# EasyEDA Pro project ProPrj_SlimeVR_BMI270_2024-07-19.epro, board PCB1_1
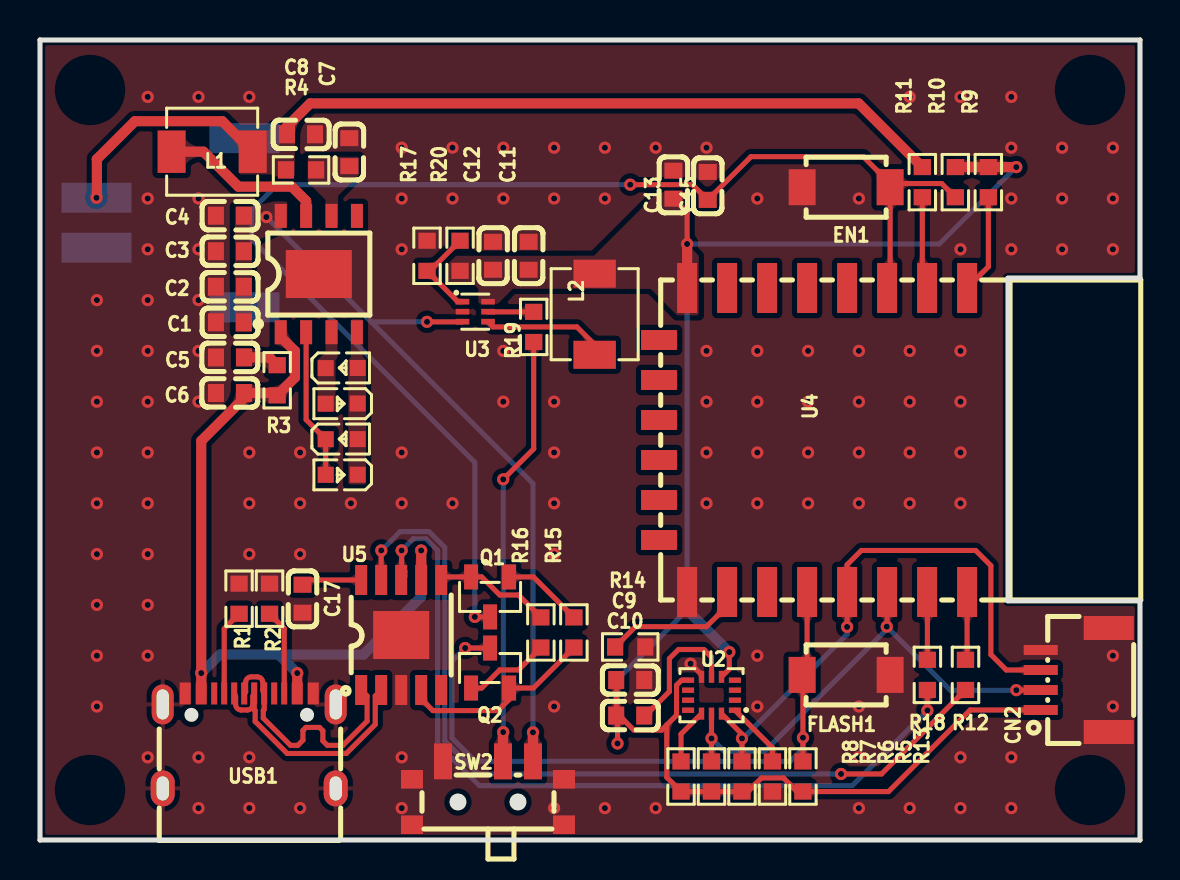
[diagram p2: board, top side]
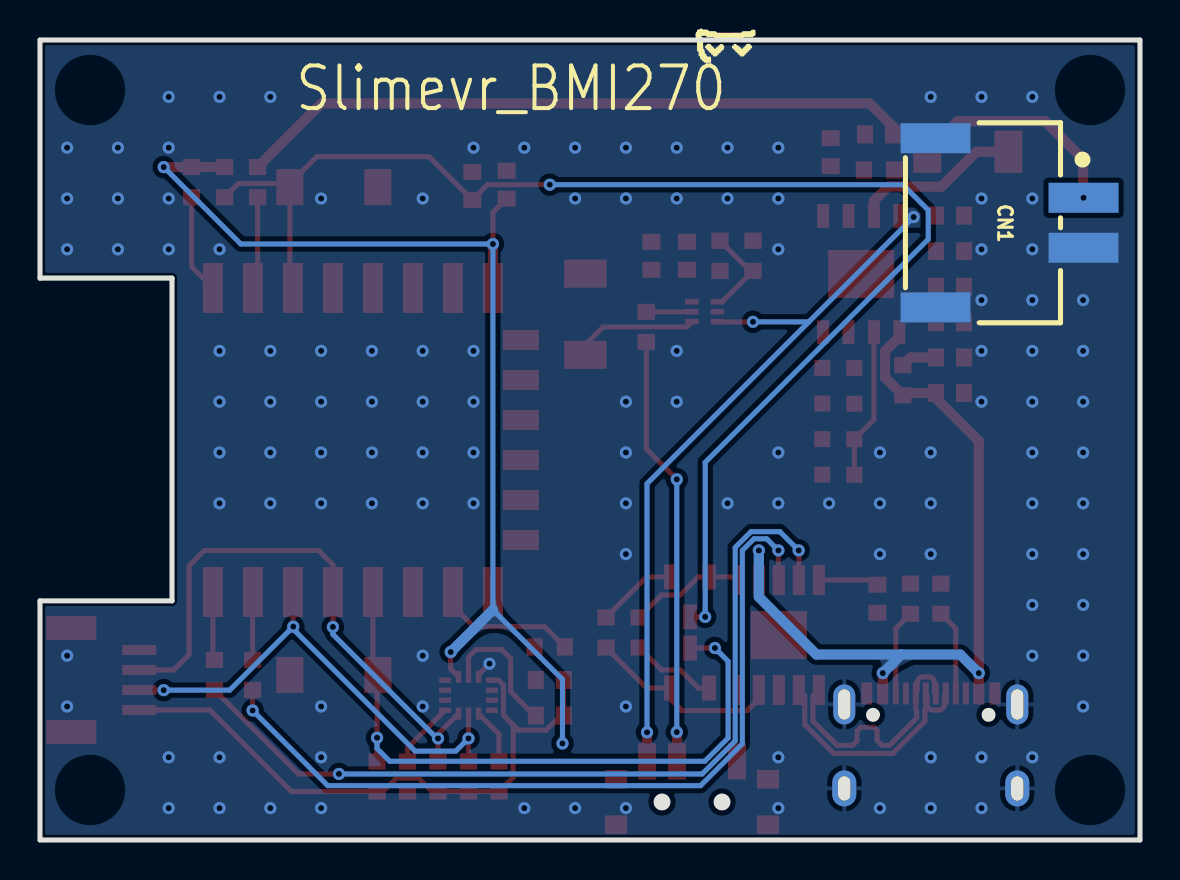
[diagram p3: board, bottom side, seen from below]

Outline 55 x 40 mm; copper layers: Top Layer, Bottom Layer. Coordinates in mm from the lower left corner of the outline.
Outline path: 0,40 0,0 55,0 55,11.96 48.4,11.96 48.4,28.09 55,28.09 55,40 0,40
Stack: Top Layer 0.035mm / Dielectric1 1.51mm FR4 er 4.5 / Bottom Layer 0.035mm

## Design rules (mm)
net D-: DP1
net D+: DP1
template: 自定义配置
spacing copperThickness1oz (default): track to track 0.102, other pairs 0.152 to 0.3
spacing copperThickness2oz: track to track 0.203, other pairs 0.152 to 0.3
track width copperThickness1oz (default): min 0.127, default 0.254, max 2.54
track width copperThickness2oz: min 0.203, default 0.254, max 2.54
differential pair differentialPair (default): width min 0.127, default 0.254, max 2.54; gap min 0.152, default 0.152
via viaSize (default): diameter min 0.5, default 0.61, max 10; hole min 0.3, default 0.305, max 6.3

## Placement (name value [footprint] x y rotation side)
C1  22uF  [C0603]  9.5 25.88 180 top
C2  22uF  [C0603]  9.5 27.66 180 top
C3  22uF  [C0603]  9.5 29.44 180 top
C4  22uF  [C0603]  9.5 31.22 180 top
C5  10uF  [C0603]  9.5 24.13 0 top
C6  10uF  [C0603]  9.5 22.35 0 top
C7  22uF  [C0603]  15.47 34.39 270 top
C8  22uF  [C0603]  13.05 35.28 180 top
C9  100nF  [C0603]  29.51 8 180 top
C10  100nF  [C0603]  29.51 6.22 180 top
C11  10uF  [C0603]  24.43 29.21 270 top
C12  10uF  [C0603]  22.65 29.21 270 top
C13  100nF  [C0603]  31.67 32.77 90 top
C15  1uF  [C0603]  33.39 32.7 270 top
C17  100nF  [C0603]  13.13 12.06 90 top
CN1  ZX-XH2.54-2PWT  [CONN-SMD_2P-P2.54_MEGASTAR_ZX-XH2.54-2PWT]  6.52 30.86 270 bottom
CN2  WAFER-SH1.0-4PWB  [CONN-SMD_4P-P1.00_WAFER-SH1.0-4PWB]  51.74 8 90 top
EN1  TS-1185-C-A-A-A  [SW-SMD_L4.0-W3.0-LS5.0-EH]  40.31 32.64 0 top
FLASH1  TS-1185-C-A-A-A  [SW-SMD_L4.0-W3.0-LS5.0-EH]  40.31 8.25 0 top
L1  1uH  [IND-SMD_L4.4-W4.2]  8.61 34.42 180 top
L2  1uH  [IND-SMD_L4.4-W4.2]  27.73 26.29 270 top
LED1  19-217/GHC-YR1S2/3T  [LED0603-RD]  15.08 18.26 180 top
LED2  NCD0603R1  [LED0603-RD_RED]  15.08 20.04 0 top
LED3  19-217/GHC-YR1S2/3T  [LED0603-RD]  15.08 21.82 180 top
LED4  NCD0603R1  [LED0603-RD_RED]  15.08 23.6 0 top
Q1  S8050  [SOT-23-3_L2.9-W1.3-P1.90-LS2.4-BR]  22.5 12.15 90 top
Q2  S8050  [SOT-23-3_L2.9-W1.3-P1.90-LS2.4-BR]  22.5 8.6 270 top
R1  5.1kΩ  [R0603]  9.95 12.06 90 top
R2  5.1kΩ  [R0603]  11.48 12.06 90 top
R3  2Ω  [R0603]  11.86 22.99 90 top
R4  500mΩ  [R0603]  13.05 33.5 180 top
R5  10K  [R0603]  36.62 3.17 90 top
R6  10K  [R0603]  35.1 3.17 270 top
R7  10K  [R0603]  33.57 3.17 270 top
R8  10K  [R0603]  32.05 3.17 270 top
R9  10kΩ  [R0603]  47.42 32.89 90 top
R10  10kΩ  [R0603]  45.77 32.89 90 top
R11  180kΩ  [R0603]  44.12 32.89 270 top
R12  0Ω  [R0603]  46.28 8.25 270 top
R13  10kΩ  [R0603]  38.15 3.17 270 top
R14  10kΩ  [R0603]  29.51 9.65 180 top
R15  10kΩ  [R0603]  26.69 10.38 90 top
R16  10kΩ  [R0603]  25.04 10.38 270 top
R17  44.2kΩ  [R0603]  19.35 29.21 270 top
R18  0Ω  [R0603]  44.37 8.25 270 top
R19  10kΩ  [R0603]  24.69 25.65 90 top
R20  200kΩ  [R0603]  21 29.21 270 top
SW2  MK-12C02-G025  [SW-SMD_MK-12C02-G025]  22.4 2.35 0 top
U1  IP5306  [ESOP-8_L4.9-W3.9-P1.27-LS6.0-BL-EP]  13.94 28.3 0 top
U2  BMI270  [LGA-14_L3.0-W2.5-P0.50-BR]  33.57 7.24 0 top
U3  MP1601GTF  [SOT-563-6_L1.6-W1.2-P0.5-LS1.6-BL]  21.76 26.42 270 top
U4  WT8266-S5 ESP-12F  [WIRELM-SMD_WT8266-S5-ESP-12F]  38.66 20 270 top
U5  CH340K  [ESOP-10_L4.9-W3.9-P1.00-LS6.2-BL-EP]  18.06 10.25 0 top
USB1  TYPE-C 16PIN 2MD(073)  [USB-C-SMD_TYPE-C-6PIN-2MD-073]  10.46 4.95 0 top

## Footprints (pads in the part's own frame, mm; a bottom-side part is the same pattern mirrored in y, then rotated)
C0603
  rect 0.8x0.9 smd: 1(-0.7,0) 2(0.7,0)
CONN-SMD_2P-P2.54_MEGASTAR_ZX-XH2.54-2PWT
  rect 1.5x3.5 smd: 1(-1.25,3.7) 2(1.25,3.7) 3(-4.23,-3.7) 4(4.23,-3.7)
CONN-SMD_4P-P1.00_WAFER-SH1.0-4PWB
  rect 0.5x1.7 smd: 1(-1.5,1.7) 2(-0.5,1.7) 3(0.5,1.7) 4(1.5,1.7)
  rect 1.2x2.5 smd: 5(-2.6,-1.7) 6(2.6,-1.7)
ESOP-8_L4.9-W3.9-P1.27-LS6.0-BL-EP
  rect 0.6x1.2 smd: 1(-1.905,-2.909) 2(-0.635,-2.909) 3(0.635,-2.909) 4(1.905,-2.909) 5(1.905,2.909) 6(0.635,2.909) 7(-0.635,2.909) 8(-1.905,2.909)
  rect 3.3x2.4 smd: 9(0,0)
ESOP-10_L4.9-W3.9-P1.00-LS6.2-BL-EP
  rect 0.6x1.5 smd: 1(-2,-2.75) 2(-1,-2.75) 3(0,-2.75) 4(1,-2.75) 5(2,-2.75) 6(2,2.75) 7(1,2.75) 8(0,2.75) 9(-1,2.75) 10(-2,2.75)
  rect 2.8x2.4 smd: 11(0,0)
IND-SMD_L4.4-W4.2
  rect 1.4x2.12 smd: 1(2.028,0) 2(-2.028,0)
LED0603-RD
  rect 0.8x0.8 smd: 1(-0.799,-0.004) 2(0.799,0.004)
LED0603-RD_RED
  rect 0.8x0.8 smd: 1(-0.799,-0.004) 2(0.799,0.004)
LGA-14_L3.0-W2.5-P0.50-BR
  rect 0.6x0.27 smd: 1(1.17,-0.75) 2(1.17,-0.25) 3(1.17,0.25) 4(1.17,0.75) 8(-1.17,0.75) 9(-1.17,0.25) 10(-1.17,-0.25) 11(-1.17,-0.75)
  rect 0.27x0.6 smd: 5(0.5,0.92) 6(0,0.92) 7(-0.5,0.92) 12(-0.5,-0.92) 13(0,-0.92) 14(0.5,-0.92)
R0603
  rect 0.806x0.864 smd: 1(-0.753,0) 2(0.753,0)
SOT-23-3_L2.9-W1.3-P1.90-LS2.4-BR
  rect 1.25x0.7 smd: 1(1,-0.95) 2(1,0.95) 3(-1,0)
SOT-563-6_L1.6-W1.2-P0.5-LS1.6-BL
  rect 0.28x0.68 smd: 1(-0.5,-0.64) 2(0,-0.64) 3(0.5,-0.64) 4(0.5,0.64) 5(0,0.64) 6(-0.5,0.64)
SW-SMD_L4.0-W3.0-LS5.0-EH
  rect 1.35x1.8 smd: 1(-2.2,0) 2(2.2,0)
SW-SMD_MK-12C02-G025
  rect 0.9x1.8 smd: 1(-2.25,1.583) 2(0.75,1.583) 3(2.25,1.583)
  rect 1.1x0.93 smd: 4(3.8,0.686) 5(3.8,-1.583) 6(-3.8,-1.583) 7(-3.8,0.686)
USB-C-SMD_TYPE-C-6PIN-2MD-073
  rect 0.55x1.1 smd: 1(-3.2,2.375) 2(-2.4,2.375) 11(2.4,2.375) 12(3.2,2.375)
  rect 0.3x1.1 smd: 3(-1.75,2.375) 4(-1.25,2.375) 5(-0.75,2.375) 6(-0.25,2.375) 7(0.25,2.375) 8(0.75,2.375) 9(1.25,2.375) 10(1.75,2.375)
  oval 1.1x2 hole 0.6x1.5: 13(-4.325,1.825) 14(4.325,1.825)
  oval 1.2x1.8 hole 0.6x1.2: 13(-4.325,-2.375) 14(4.325,-2.375)
WIRELM-SMD_WT8266-S5-ESP-12F
  rect 2.5x1 smd: 1(-7.6,7.7) 2(-7.6,5.7) 3(-7.6,3.7) 4(-7.6,1.7) 5(-7.6,-0.3) 6(-7.6,-2.3) 7(-7.6,-4.3) 8(-7.6,-6.3) 9(7.6,-6.3) 10(7.6,-4.3) 11(7.6,-2.3) 12(7.6,-0.3) 13(7.6,1.7) 14(7.6,3.7) 15(7.6,5.7) 16(7.6,7.7)
  rect 1x1.8 smd: 17(-5,-7.7) 18(-3,-7.7) 19(-1,-7.7) 20(1,-7.7) 21(3,-7.7) 22(5,-7.7)

## Nets
As in the schematic, except:
3V3: C9.2 C10.2 C11.2 C12.2 C13.1 CN2.1 L2.2 R6.2 R7.2 R8.2 R9.2 R10.2 R13.2 R20.2 U2.5 U2.8 U3.6 U4.8
CS: R8.1 U2.12

Pads without a net: U1 5; U2 2 3 4 9 10 11; U4 4 5 6 7 11 17 18 19 20 21 22; U5 5; USB1 3 9

## Via types
v1: diameter 0.61, hole 0.305, Top Layer to Bottom Layer, 146 vias

## Routing (per net, layer and track width the routed paths; a pad name or vN(x,y) marks a point on that pad's centre or on a via; arc(x,y) is an arc through that point)
3V3: length 89.5
  Top Layer w0.254: 31.34,5.75 31.34,3.13 R8.2 R7.2 R6.2 35.39,2.42 36.08,3.1 37.17,3.1 37.85,2.42 R13.2 42.43,2.42 46.51,6.5 CN2.1 ; 31.34,5.75 31.08,5.49 29.7,5.49 28.97,6.22 C10.2 C9.2 ; 31.34,5.75 31.83,6.24 31.83,7.74 32.08,7.99 U2.8 ; U2.5 34.46,8.55 v1(34.46,9.4) ; v1(32.35,29.8) 32.35,31.38 C13.1 ; v1(28.88,4.83) 28.88,6.16
  Top Layer w0.508: 28.88,6.16 C10.2 ; v1(48.81,33.65) R9.2 R10.2 ; U4.8 v1(32.35,29.8)
  Bottom Layer w0.254: v1(28.88,4.83) 28.88,8.03 32.35,11.51 v1(32.35,29.8) 44.96,29.8 48.81,33.66
  Bottom Layer w0.508: v1(34.46,9.4) 32.35,11.51
5V: length 37.1
  Top Layer w0.254: v1(19.35,25.91) 21.12,25.91 U3.3
  Top Layer w0.508: 24.65,4.11 v1(24.65,5.38)
  Bottom Layer w0.254: v1(24.65,5.38) 24.65,17.82 16.56,25.91 ; 16.56,25.91 v1(19.35,25.91) ; 16.56,25.91 v1(11.32,31.15)
GND: length 0.9
  Top Layer w0.254: 33.07,8.17 33.07,8.27 v1(32.53,8.81)
  vias: v1(2.84,27) v1(2.84,24.45) v1(2.84,21.92) v1(2.84,19.38) v1(2.84,16.83) v1(2.84,14.3) v1(2.84,11.75) v1(2.84,9.22) v1(2.84,6.67) v1(5.38,37.16) v1(5.38,32.08) v1(5.38,29.53) v1(5.38,27) v1(5.38,24.45) v1(5.38,21.92) v1(5.38,19.38) v1(5.38,16.83) v1(5.38,14.3) v1(5.38,11.75) v1(5.38,9.22) v1(5.38,4.14) v1(7.93,37.16) v1(7.93,32.08) v1(7.93,29.53) v1(7.93,27) v1(7.93,24.45) v1(7.93,21.92) v1(7.93,4.14) v1(7.93,1.59) v1(10.47,37.16) v1(10.47,19.38) v1(10.47,16.83) v1(10.47,14.3) v1(10.47,4.14) v1(10.47,1.59) v1(13,19.38) v1(13,16.83) v1(13,14.3) v1(13,1.59) v1(15.54,16.83) v1(18.09,34.61) v1(18.09,32.08) v1(18.09,29.53) v1(18.09,19.38) v1(18.09,16.83) v1(18.09,4.14) v1(18.09,1.59) v1(20.62,34.61) v1(20.62,32.08) v1(20.62,16.83) v1(23.16,34.61) v1(23.16,32.08) v1(23.16,24.45) v1(23.16,21.92) v1(25.71,34.61) v1(25.71,32.08) v1(25.71,21.92) v1(25.71,19.38) v1(25.71,16.83) v1(25.71,14.3) v1(25.71,6.67) v1(25.71,1.59) v1(28.25,34.61) v1(28.25,32.08) v1(28.25,1.59) v1(30.78,34.61) v1(30.78,1.59) v1(33.32,34.61) v1(33.32,24.45) v1(33.32,21.92) v1(33.32,19.38) v1(33.32,16.83) v1(35.87,32.08) v1(35.87,24.45) v1(35.87,21.92) v1(35.87,19.38) v1(35.87,16.83) v1(35.87,9.22) v1(35.87,6.67) v1(38.41,24.45) v1(38.41,21.92) v1(38.41,19.38) v1(38.41,16.83) v1(40.94,32.08) v1(40.94,24.45) v1(40.94,21.92) v1(40.94,19.38) v1(40.94,16.83) v1(40.94,6.67) v1(40.94,4.14) v1(40.94,1.59) v1(43.49,37.16) v1(43.49,24.45) v1(43.49,21.92) v1(43.49,19.38) v1(43.49,16.83) v1(43.49,1.59) v1(46.03,37.16) v1(46.03,29.53) v1(46.03,24.45) v1(46.03,21.92) v1(46.03,19.38) v1(46.03,16.83) v1(46.03,4.14) v1(46.03,1.59) v1(48.56,37.16) v1(48.56,34.61) v1(48.56,32.08) v1(48.56,29.53) v1(48.56,4.14) v1(48.56,1.59) v1(51.1,34.61) v1(51.1,32.08) v1(51.1,29.53) v1(53.65,34.61) v1(53.65,32.08) v1(53.65,29.53) v1(53.65,9.22) v1(53.65,6.67)
VBAT: length 45.1
  Top Layer w0.508: 2.84,32.11 2.84,34.03 2.84,34.04 4.75,35.94 9.11,35.94 L1.2 ; R11.1 40.93,36.83 13.51,36.83 12.35,35.67 C8.2
  vias: v1(2.82,32.11)
VBUS: length 40.7
  Top Layer w0.508: 12.86,7.33 v1(12.86,8.34) ; 12.04,25.52 12.04,25.16 12.75,24.45 12.75,23.12 R3.1 11.74,22.35 C6.2 10.2,22.09 8.06,19.95 v1(8.06,8.34) USB1.2 ; 19.06,12.55 v1(19.06,14.48)
  Bottom Layer w0.508: 11.93,9.27 8.99,9.27 v1(8.06,8.34) ; 11.93,9.27 16.18,9.27 19.06,12.15 v1(19.06,14.48) ; 11.93,9.27 v1(12.86,8.34)
CH340_RXD: length 43.5
  Top Layer w0.254: v1(40.05,3.3) 42.08,3.3 R12.2 ; U5.9 17.06,14.47 v1(17.06,14.48)
  Bottom Layer w0.254: v1(17.06,14.48) 18,15.42 19.45,15.42 20.24,14.62 20.24,4.95 21.89,3.3 v1(40.05,3.3)
CH340_TXD: length 41.5
  Top Layer w0.254: v1(44.37,6.48) R18.2 ; v1(18.08,14.48) 18.08,13.59 18.24,13.43 18.24,13.18 U5.8
  Bottom Layer w0.254: v1(44.37,6.48) 40.61,2.72 21.97,2.72 19.88,4.81 19.88,14.48 19.3,15.06 18.66,15.06 v1(18.08,14.48)
CS: length 2.8
  Top Layer w0.254: R8.1 32.05,5.3 U2.12
D+: length 12.8
  Top Layer w0.254: USB1.6 10.28,7.4 arc(10.28,7.4) 10.28,7.4 10.28,7.88 arc(10.36,8.08) 10.56,8.16 10.86,8.16 arc(11.06,8.08) 11.14,7.88 11.14,7.5 arc(11.16,7.41) USB1.8 11.21,6.52 11.16,6.48 11.16,6.09 12.53,4.73 12.89,4.73 13.15,4.99 13.15,5.48 13.3,5.63 13.98,5.63 14.14,5.46 14.14,4.96 14.37,4.73 15.14,4.73 16.35,5.94 16.35,7.2 U5.1
D-: length 12.8
  Top Layer w0.254: U5.2 16.76,7.2 16.76,5.78 15.31,4.33 12.36,4.33 10.76,5.93 10.76,6.48 10.71,6.52 USB1.7 arc(10.66,7.25) 10.64,7.16 10.64,6.78 arc(10.56,6.58) 10.36,6.5 10.06,6.5 arc(9.86,6.58) 9.78,6.78 9.78,7.16 arc(9.76,7.25) USB1.5
DC_SW: length 2.3
  Top Layer w0.254: U3.5 22.41,26.41 R19.2
DTR: length 10
  Top Layer w0.254: U5.4 19.06,7.06 19.64,6.47 22.9,6.47 23.45,7.02 Q2.2 24.67,7.6 26.69,9.62
EN: length 68.6
  Top Layer w0.254: U4.3 42.51,27.75 EN1.2 ; v1(29.51,32.77) 32.62,32.77 C15.2 35.55,34.17 41.16,34.17 42.51,32.82 45.09,32.82 R10.1 ; Q1.3 v1(21.74,11.15)
  Bottom Layer w0.254: v1(21.74,11.15) 21.74,18.88 10.59,30.03 10.59,31.5 11.86,32.77 v1(29.51,32.77)
IO0: length 33.1
  Top Layer w0.254: FLASH1.1 38.15,8.21 38.35,8.42 U4.12 ; R13.1 v1(38.15,5.11) 38.15,7.83 ; Q2.3 v1(21.26,9.6)
  Bottom Layer w0.254: 38.15,5.08 38.15,4.57 37.51,3.94 21.76,3.94 20.6,5.1 20.6,8.94 v1(21.26,9.6)
RTS: length 5.9
  Top Layer w0.254: U5.6 20.21,13.15 Q1.2 22.08,13.15 22.99,12.25 23.92,12.25 R16.1
SCL: length 24.8
  Top Layer w0.254: v1(42.34,10.67) 42.35,10.69 U4.14 ; U2.13 v1(33.57,5.08) R7.1 ; CN2.2 50.03,7.49 v1(48.81,7.49)
  Bottom Layer w0.254: v1(48.81,7.49) 45.51,7.49 v1(42.34,10.67) 42.34,10.54 36.24,4.44 34.21,4.44 v1(33.57,5.08)
SDA: length 28.7
  Top Layer w0.254: v1(40.35,10.65) U4.13 40.35,13.77 41.07,14.48 46.78,14.48 47.54,13.72 47.54,9.27 48.31,8.5 CN2.3 ; U2.14 35.1,5.3 v1(35.1,5.08) R6.1
  Bottom Layer w0.254: 35.16,5.09 40.35,10.28 v1(40.35,10.65)
SW: length 21.4
  Top Layer w0.254: R19.1 24.69,19.56 v1(23.16,18.03)
  Top Layer w0.508: 23.15,4.11 23.15,5.38
  Bottom Layer w0.254: v1(23.16,5.39) v1(23.16,18.03)
$1N315: length 4.3
  Top Layer w0.254: R2.1 12.21,10.58 USB1.10
$1N353: length 4.3
  Top Layer w0.254: USB1.4 9.21,10.57 R1.1
$1N1430: length 1.8
  Top Layer w0.508: C5.2 11.47,24.13 R3.2
$1N1434: length 8.4
  Top Layer w0.508: L1.1 8.17,34.42 9.92,32.67 12.59,32.67 13.31,31.95 13.31,31.33
$1N1435: length 0.3
  Top Layer w0.508: 13.81,33.38 13.93,33.38 13.81,33.5
$1N1807: length 7.7
  Top Layer w0.254: 13.31,25.52 13.31,21.02 14.28,20.04 LED1.2
$1N4879: length 3.3
  Top Layer w0.254: U2.1 36.62,4.61 R5.2
$1N4904: length 6.8
  Top Layer w0.254: 30.21,6.22 30.27,6.22 31.47,7.42 31.47,9.07 31.92,9.53 33.19,9.53 33.57,9.14 U2.6
$1N5427: length 4.3
  Top Layer w0.254: 25.04,9.62 23.92,8.5 22.99,8.5 22.08,7.6 Q2.1
$1N5432: length 4.1
  Top Layer w0.254: Q1.1 24.67,13.15 R15.2
$1N5994: length 7.1
  Top Layer w0.254: U4.10 34.35,11.7 33.32,10.67 29.77,10.67 R14.2
$1N6007: length 5
  Top Layer w0.254: U4.1 47.42,28.66 R9.1
$1N6011: length 4.6
  Top Layer w0.254: R11.2 44.12,27.84 U4.2
$1N6193: length 3.4
  Top Layer w0.254: U4.16 46.35,9.09 R12.1
$1N6195: length 3.4
  Top Layer w0.254: R18.1 44.37,12.39 U4.15
$1N6282: length 3
  Top Layer w0.254: U5.10 13.36,13 C17.2
$1N16194: length 4.7
  Top Layer w0.254: U3.1 20.89,26.92 R17.2 19.5,28.46 R20.1
$1N16281: length 6.3
  Top Layer w0.254: U3.4 22.4,25.9 22.65,25.65 26.84,25.65 27.73,24.77 L2.1

## Copper pours and planes (outline as drawn; the poured copper is in the pictures)
3V3 on Top Layer: 20.39,29.21 32.81,29.21 32.81,27.56 23.64,27.56 22.78,26.7 21.92,26.7 21.92,27.55 21.58,27.89 20.34,27.89 20.34,29.16
3V3 on Top Layer: 26.46,29.21 27.69,29.21 30.95,32.47 32.18,32.47 32.18,31.56 32.35,31.38 32.35,29.8 32.94,29.21 32.94,26.23 31.85,26.23 30.53,27.56 28.11,27.56
5V on Top Layer: 11.73,31.93 12.37,31.93 12.37,30.71 10.59,29.83 10.59,25.39 9.75,25.39 9.75,31.68 10.59,31.68
GND on Top Layer: 0,40 55,40 55,0 0,0
GND on Bottom Layer: 0,40 55,40 55,0 0,0
VBAT on Top Layer: 9.95,35.43 9.95,33.27 11.64,33.27 11.86,33.05 12.75,33.05 12.75,35.74 11.66,35.74 11.35,35.43
$1N1435 on Top Layer: 14.27,30.73 14.27,32 13.38,32.89 13.38,34.04 13.38,34.16 15.96,34.16 15.96,33.26 14.91,32.21 14.91,30.73
$1N1813 on Top Layer: 14.27,26.03 14.88,26.03 14.88,24.1 14.78,24 14.78,21.42 13.88,21.42 13.88,24 14.27,24.39
$1N1819 on Top Layer: 15.54,26.03 16.14,26.03 16.14,24.17 16.3,24 16.3,17.78 15.41,17.78 15.41,24 15.54,24.13

Small or netless copper shapes (teardrops, artwork), in the pictures only: 133 on Top Layer, 26 on Bottom Layer

## Text on the board
Bottom Silkscreen Layer: Slimevr_BMI270
